# Altium project Line Follower 3.0.PrjPcb
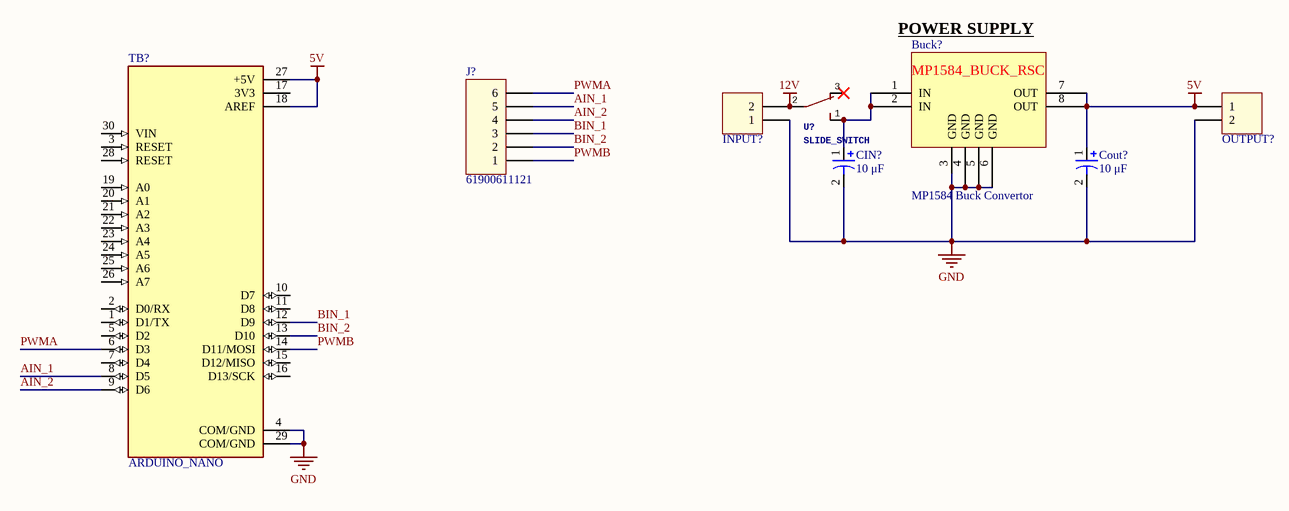
[diagram p0: Schematic.SchDoc]
1 sheet, 8 parts. Net scope: global (net labels, ports and power ports of the same name join across sheets).
Board file: PCB.PcbDoc

## Sheet Schematic.SchDoc
size A4

### Parts
Buck?  MP1584 Buck Convertor  [MP1584]
CIN?  10 μF  [WCAP-AT1H 5x11x2x0.5]
Cout?  10 μF  [WCAP-AT1H 5x11x2x0.5]
INPUT?  691311500102  [691311500102]  (value not drawn)
J?  61900611121  [61900611121]
OUTPUT?  691311500102  [691311500102]  (value not drawn)
TB?  ARDUINO_NANO  [SHIELD_ARDUINO_NANO]
U?  SLIDE_SWITCH  [SPDT]

### Nets
5V: Buck?.7(OUT) Buck?.8(OUT) Cout?.1 OUTPUT?.1 TB?.18(AREF) TB?.27(+5V)
12V: INPUT?.2 U?.2(P)
GND: Buck?.3(GND) Buck?.4(GND) Buck?.5(GND) Buck?.6(GND) CIN?.2 Cout?.2 INPUT?.1 OUTPUT?.2 TB?.4(COM/GND) TB?.29(COM/GND)
AIN_1: J?.5 TB?.8(D5)
AIN_2: J?.4 TB?.9(D6)
BIN_1: J?.3 TB?.12(D9)
BIN_2: J?.2 TB?.13(D10)
PWMA: J?.6 TB?.6(D3)
PWMB: J?.1 TB?.14(D11/MOSI)
NetBuck?_1: Buck?.1(IN) Buck?.2(IN) CIN?.1 U?.1(NO)

Not connected (* = marked no-connect by the designer): TB? 1(D1/TX) 2(D0/RX) 3(RESET) 5(D2) 7(D4) 10(D7) 11(D8) 15(D12/MISO) 16(D13/SCK) 17(3V3) 19(A0) 20(A1) 21(A2) 22(A3) 23(A4) 24(A5) 25(A6) 26(A7) 28(RESET) 30(VIN); U? 3(NC)*

### Notes on the sheet
- POWER SUPPLY
- (in symbol MP1584 Buck Convertor) MP1584_BUCK_RSC

### Library data of the parts
CIN? Cout? = WCAP-AT1H 5x11x2x0.5 860240672002: WCAP-AT1H Aluminum Electrolytic Capacitors , 10 μF; + / - 20%; 50 V , 5 x 11; Manufacturer: Wurth Elektronik; E-mail: libraries@we-online.com; Characteristics: Aluminum Electrolytic Capacitor; Recommended soldering: Wave; Operating temperature:–40 °C to +105 °C for UR < 400 V; –25 °C to +105 °C for UR ≥ 400 V; Long life product series; Higher permissible ripple current; Load life: 5000–10000 h @ +105 °C; ComponentLink1Description: Manufacturer; ComponentLink1URL: http://www.we-online.com; ComponentLink2Description: Datasheet; ComponentLink2URL: http://katalog.we-online.de/pbs/datasheet/860240672002.pdf; Created by: Karrer Zheng; Created Date: 6/8/2015; Capacitance: 10 μF; Application: Medium and high voltage type range from 160V-450V used as primary side input filter in power supply; Low voltage type used as energy storage or low frequency filtering in circuit, applied to general switching power supply, AC-DC converter, adapter, charger, TV, VCR, DC motor circuit filter, digital audio, digital cameras, digital video cameras, satellite receiver etc.; partNo: 860240672002
INPUT? OUTPUT? = 691311500102: WR-TBL Serie 311 - 5.08 mm Close Vertical PCB Header, 02p; Pitch: 5.08 mm; ComponentLink1Description: Manufacturer; ComponentLink1URL: http://www.we-online.de; ComponentLink2Description: Datasheet; ComponentLink2URL: http://katalog.we-online.de/em/datasheet/6913115001xx.pdf; Part Number: 691311500102; Published Date: Feb. 2017; Publisher: Wurth Elektronik; Pin Number: 02p
J? = 61900611121: WR-WTB 2.54mm Male Locking Header, 6p; Pin Number: 6; ComponentLink1Description: Manufacturer; ComponentLink1URL: http://www.we-online.de; ComponentLink2Description: Datasheet; ComponentLink2URL: http://katalog.we-online.de/em/datasheet/6190xx11121.pdf; Part Number: 61900611121; Published Date: June 2017; Publisher: Wurth Elektronik; Pitch: 2.54 mm
TB? = ARDUINO_NANO: Small, complete, and breadboard-friendly board based on the ATmega328 (Arduino Nano 3.x); Check_prices: https://www.snapeda.com/parts/Arduino%20Nano/Arduino/view-part/?ref=eda; Value: *; Availability: Not in stock; MP: Arduino Nano; Price: None; Package: Non-Standard Arduino; SnapEDA_Link: https://www.snapeda.com/parts/Arduino%20Nano/Arduino/view-part/?ref=snap; MF: Arduino